# EAGLE design doublesidedflasher (EAGLE 7.6.0)
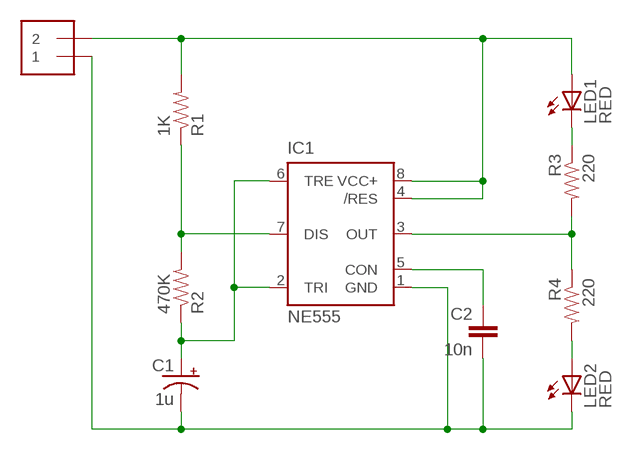
[diagram p0: schematic, sheet 1]

## Parts
C1  1u  CAP_POLPTH2  [CPOL-RADIAL-10UF-25V]
C2  10n  CAPPTH  [CAP-PTH-SMALL]
IC1  NE555  [DIL-08]
J1  1X2-3.5MM  [1X2-3.5MM]
LED1  RED  LED5MM  [LED5MM]
LED2  RED  LED5MM  [LED5MM]
R1  1K  RESISTORAXIAL-0.3  [AXIAL-0.3]
R2  470K  RESISTORAXIAL-0.3  [AXIAL-0.3]
R3  220  RESISTORAXIAL-0.3  [AXIAL-0.3]
R4  220  RESISTORAXIAL-0.3  [AXIAL-0.3]

## Nets
GND: C1.2(-) C2.2 IC1.1(GND) J1.1 LED2.K(C)
N$1: IC1.7(DIS) R1.P$1 R2.P$2
N$3: LED2.A R4.P$2
N$4: LED1.K(C) R3.P$1
N$5: IC1.3(OUT) R3.P$2 R4.P$1
N$6: C1.1(+) IC1.2(TRI) IC1.6(TRE) R2.P$1
N$8: C2.1 IC1.5(CON)
VCC+: IC1.4(/RES) IC1.8(VCC+) J1.2 LED1.A R1.P$2

## Library data of the parts
C1 = SparkFun-Passives:CAP_POL: Capacitor Polarized These are standard SMD and PTH capacitors. Normally 10uF, 47uF, and 100uF in electrolytic and tantalum varieties. Always verify the external diameter of the through hole cap, it varies with capacity, voltage, and manufacturer. The EIA devices should be standard.
C2 = SparkFun-Capacitors:CAP: Capacitor Standard 0603 ceramic capacitor, and 0.1" leaded capacitor.
IC1 = st-microelectronics:NE555: General purpose bipolar Timer; MF: Arrow Electronics; MPN: NE555N; OC_FARNELL: 1467742; OC_NEWARK: 89K1486
J1 = adafruit:1X2: 3.5mm Terminal block http://www.ladyada.net/library/pcb/eaglelibrary.html
LED1 LED2 = adafruit:LED: LED OSRAM: - CHIPLED LG R971, LG N971, LY N971, LG Q971, LY Q971, LO R971, LY R971 LH N974, LH R974 LS Q976, LO Q976, LY Q976 LO Q996 - Hyper CHIPLED LW Q18S LB Q993, LB Q99A, LB R99A - SideLED LS A670, LO A670, LY A670, LG A670, LP A670 LB A673, LV A673, LT A673, LW A673 LH A674 LY A675 LS A676, LA A676, LO A676, LY A676, LW A676 LS A679, LY A679, LG A679 - Hyper Micro SIDELED® LS Y876, LA Y876, LO Y876, LY Y876 LT Y87S - SmartLED LW L88C, LW L88S LB L89C, LB L89S, LG L890 LS L89K, LO L89K, LY L89K LS L896, LA L896, LO L896, LY L896 - TOPLED LS T670, LO T670, LY T670, LG T670, LP T670 LSG T670, LSP T670, LSY T670, LOP T670, LYG T670 LG T671, LOG T671, LSG T671 LB T673, LV T673, LT T673, LW T673 LH T674 LS T676, LA T676, LO T676, LY T676, LB T676, LH T676, LSB T676, LW T676 LB T67C, LV T67C, LT T67C, LS T67K, LO T67K, LY T67K, LW E67C LS E67B, LA E67B, LO E67B, LY E67B, LB E67C, LV E67C, LT E67C LW T67C LS T679, LY T679, LG T679 LS T770, LO T770, LY T770, LG T770, LP T770 LB T773, LV T773, LT T773, LW T773 LH T774 LS E675, LA E675, LY E675, LS T675 LS T776, LA T776, LO T776, LY T776, LB T776 LHGB T686 LT T68C, LB T68C - Hyper Mini TOPLED® LB M676 - Mini TOPLED Santana® LG M470 LS M47K, LO M47K, LY M47K Source: http://www.osram.convergy.de/
R1-R4 = SparkFun-Passives:RESISTOR: Resistor Basic schematic elements and footprints for 0603, 1206, and PTH resistors.

## Board
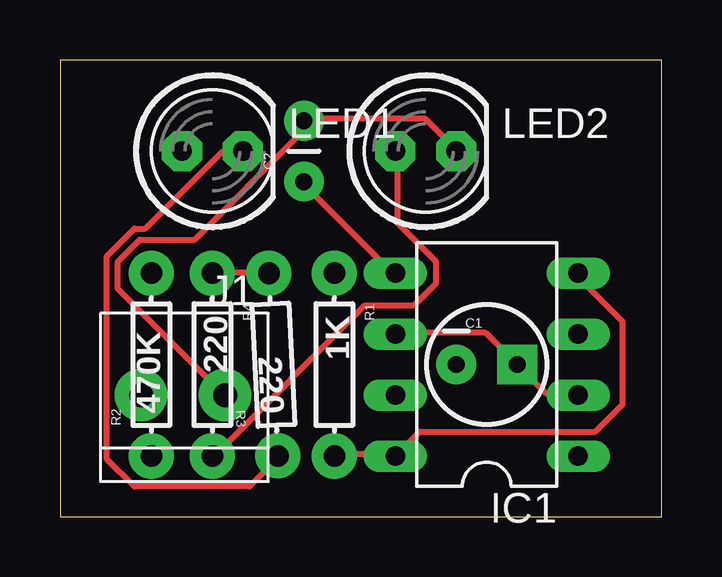
[diagram p1: board, top side]
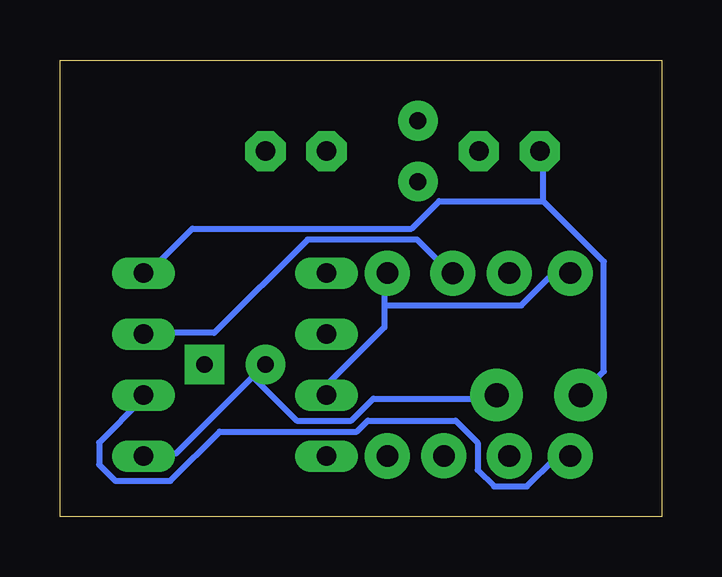
[diagram p2: board, bottom side, seen from below]

Size 25.07 x 19.04 mm. Coordinates in mm from the lower left corner, seen from the top.
Outline: 0,0 25.07,0 25.07,19.04 0,19.04 0,0
Copper layers (1*16): Top 0.035mm / dielectric 1.5mm / Bottom 0.035mm
Design rules "default": minimum track width 10mil, minimum drill 24mil, track to track 8mil, track to pad 8mil, pad to pad 8mil, via to via 8mil, smd to smd 8mil, copper to edge 40mil, drill to drill 8mil, minimum pad ring 10mil, minimum via ring 8mil, stop-mask expansion 4mil, vias tented up to drill 0mil, thermal gap 10mil

### Footprints (pad centres in the part's own frame; a part is rotated, then mirrored left to right if it is on the bottom)
CPOL-RADIAL-10UF-25V = drill 0.7 pad 1.651 square: 1 1.27,0 | drill 0.7 pad 1.651: 2 -1.27,0
CAP-PTH-SMALL = drill 0.7 pad 1.651: 1 0,0; 2 2.54,0
DIL-08 = drill 0.813 long: 1 -3.81,-3.81; 2 -1.27,-3.81; 3 1.27,-3.81; 4 3.81,-3.81; 5 3.81,3.81; 6 1.27,3.81; 7 -1.27,3.81; 8 -3.81,3.81
1X2-3.5MM = drill 1 pad 2.184: 1 1.8,0; 2 -1.7,0
LED5MM = drill 0.813 pad 1.676 octagon: A -1.27,0; K 1.27,0
AXIAL-0.3 = drill 0.9 pad 1.88: P$1 -3.81,0; P$2 3.81,0

### Placement (x,y rotation side)
C1  17.78,6.35 0 top
C2  10.16,13.97 90 top
IC1  17.78,6.35 90 top
J1  5.08,5.08 0 top
LED1  6.35,15.24 0 top
LED2  15.24,15.24 0 top
R1  11.43,6.35 270 top
R2  3.81,6.35 90 top
R3  8.89,6.35 92.8 top
R4  6.35,6.35 270 top

### Tracks (layer width: path | path; a pad name or v marks a point on that pad's centre or on a via)
GND
  Top 0.254: LED2.K 16.36,15.44 15.21,16.59 10.18,16.59 C2.2 9.96,16.36 9.96,15.9 5.61,11.56 3.33,11.56 2.41,10.64 2.41,9.5 6.76,5.16 J1.1
  Bottom 0.254: 17.04,5.84 16.59,6.3 C1.2 17.04,5.84 | 17.04,5.84 20.24,2.64 21.39,2.64 IC1.1 | 17.04,5.84 15.21,4.01 12.93,4.01 12.01,4.93 6.98,4.93 J1.1
N$1
  Bottom 0.254: 11.56,8.81 11.56,9.96 R1.P$1 | 11.56,8.81 11.56,7.9 13.84,5.61 13.84,5.16 IC1.7 | 11.56,8.81 5.84,8.81 4.7,9.96 4.01,9.96 R2.P$2
N$3
  Top 0.254: LED2.A 14.07,15.21 14.07,12.24 15.67,10.64 15.67,9.73 14.76,8.81 12.7,8.81 6.53,2.64 R4.P$2
N$4
  Top 0.254: LED1.K 7.44,15.21 6.76,15.21 3.56,12.01 3.1,12.01 1.96,10.87 1.96,2.41 3.1,1.27 7.9,1.27 9.04,2.41 R3.P$1
N$5
  Top 0.254: R4.P$1 6.53,10.18 8.59,10.18 R3.P$2
  Bottom 0.254: IC1.3 21.39,7.67 18.64,7.67 14.76,11.56 10.18,11.56 8.81,10.18 R3.P$2
N$6
  Top 0.254: IC1.6 14.07,7.67 17.73,7.67 C1.1 20.24,5.16 21.39,5.16 IC1.2
  Bottom 0.254: R2.P$1 4.01,2.41 4.47,2.41 5.61,1.27 6.98,1.27 7.67,1.96 7.67,3.1 8.59,4.01 12.24,4.01 12.7,3.56 18.41,3.56 20.47,1.5 22.76,1.5 23.44,2.18 23.44,3.1 21.61,4.93 IC1.2
N$8
  Top 0.254: IC1.5 13.84,10.18 10.18,13.84 C2.1
VCC+
  Top 0.254: R1.P$2 11.56,2.64 13.84,2.64 IC1.8 14.99,3.56 22.3,3.56 23.44,4.7 23.44,8.13 21.61,9.96 IC1.4
  Bottom 0.254: 4.93,13.16 4.93,15.21 LED1.A | 4.93,13.16 2.41,10.64 2.41,6.07 3.33,5.16 J1.2 | 4.93,13.16 9.27,13.16 10.41,12.01 19.56,12.01 21.39,10.18 IC1.4